# Altium schematic sheet LED_Schematic_v2.SchDoc
size A
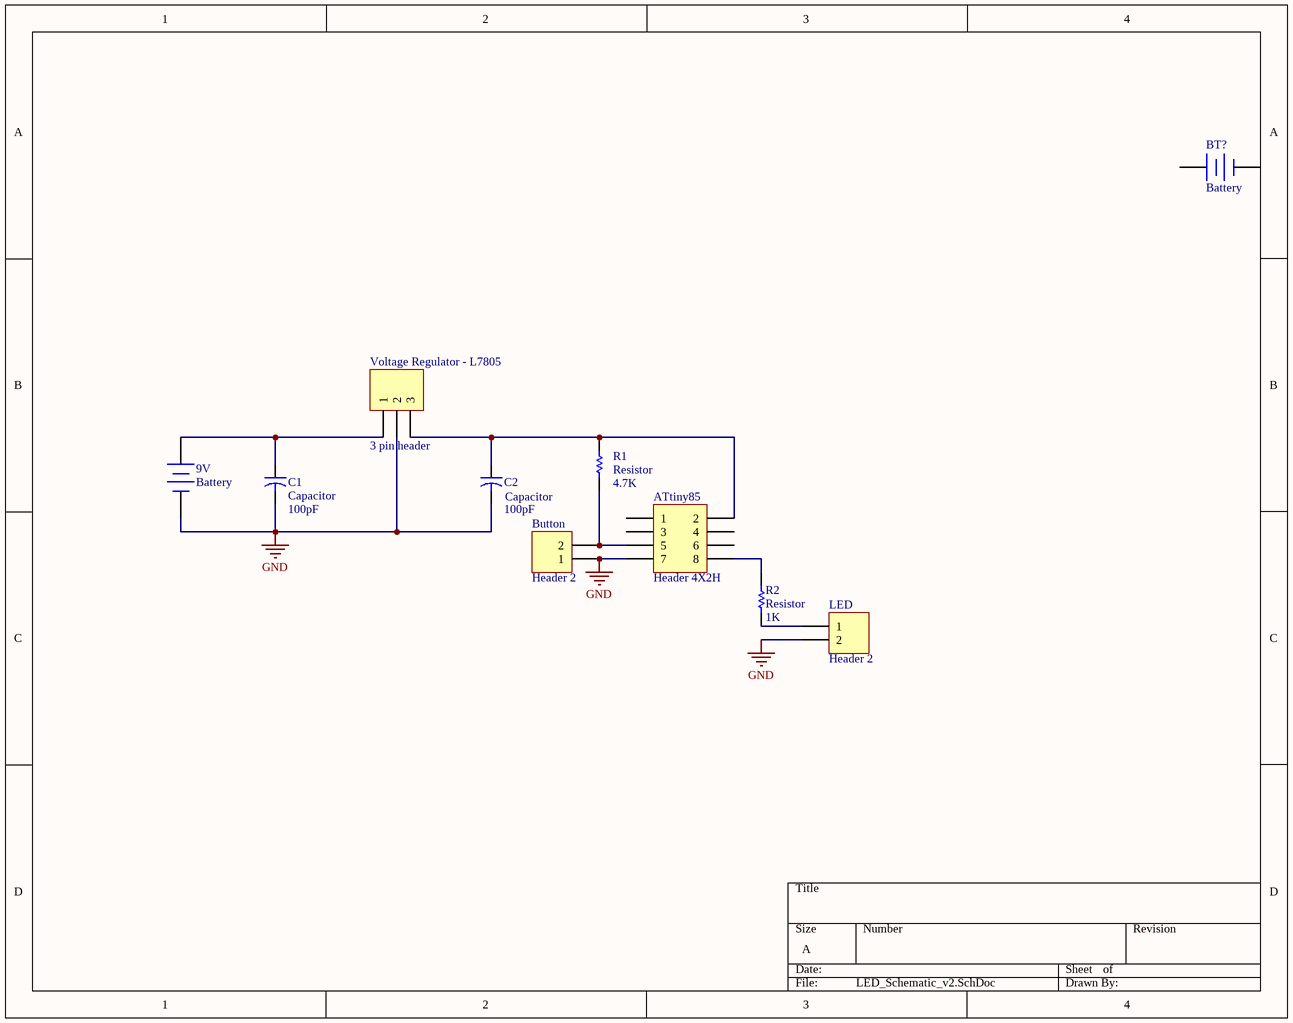
[diagram p0: LED_Schematic_v2.SchDoc]

## Parts
9V  Battery  [BAT-2]
ATtiny85  Header 4X2H  [HDR2X4H]
BT?  Battery  [BAT-2]
Button  Header 2  [HDR1X2]
C1  Capacitor  value 100pF  [CAPR5-4X5]
C2  Capacitor  value 100pF  [CAPR5-4X5]
LED  Header 2  [HDR1X2]
R1  Resistor  value 4.7K  [AXIAL-0.3]
R2  Resistor  value 1K  [AXIAL-0.3]
Voltage_Regulator_-_L7805  3 pin header  [HDR1X3]

## Nets
GND: 9V.2(-) ATtiny85.7 Button.1 C1.2 C2.2 LED.2 Voltage_Regulator_-_L7805.2
Net9V_1: 9V.1(+) C1.1 Voltage_Regulator_-_L7805.1
NetATtiny85_2: ATtiny85.2 C2.1 R1.1 Voltage_Regulator_-_L7805.3
NetATtiny85_5: ATtiny85.5 Button.2 R1.2
NetATtiny85_8: ATtiny85.8 R2.2
NetLED_1: LED.1 R2.1

Not connected (* = marked no-connect by the designer): ATtiny85 1 3 4 6; BT? 1(+) 2(-)

## Library data of the parts
9V BT? = Battery: Multicell Battery; Published: 24-Mar-1999; LatestRevisionDate: 17-Jul-2002; LatestRevisionNote: Re-released for DXP Platform.; PackageReference: BAT-2; Publisher: Altium Limited; PackageDescription: Battery; 2 Leads
ATtiny85 = Header 4X2H: Header, 4-Pin, Dual row, Right Angle; LatestRevisionDate: 17-Jul-2002; LatestRevisionNote: Re-released for DXP Platform.; Publisher: Altium Limited
Button LED = Header 2: Header, 2-Pin; LatestRevisionDate: 17-Jul-2002; LatestRevisionNote: Re-released for DXP Platform.; Publisher: Altium Limited
C1 C2 = Cap2: Published: 23-Sep-2002; PackageReference: CAPR5-4X5; Publisher: Altium Limited; PackageDescription: Capacitor; 2 Leads
R1 R2 = Res1: Published: 8-Jun-2000; LatestRevisionDate: 17-Jul-2002; LatestRevisionNote: Re-released for DXP Platform.; PackageReference: AXIAL-0.3; Publisher: Altium Limited; PackageDescription: Axial Device, Thru-Hole; 2 Leads; 0.3 in Pin Spacing
Voltage_Regulator_-_L7805 = Header 3: Header, 3-Pin; LatestRevisionDate: 17-Jul-2002; LatestRevisionNote: Re-released for DXP Platform.; Publisher: Altium Limited